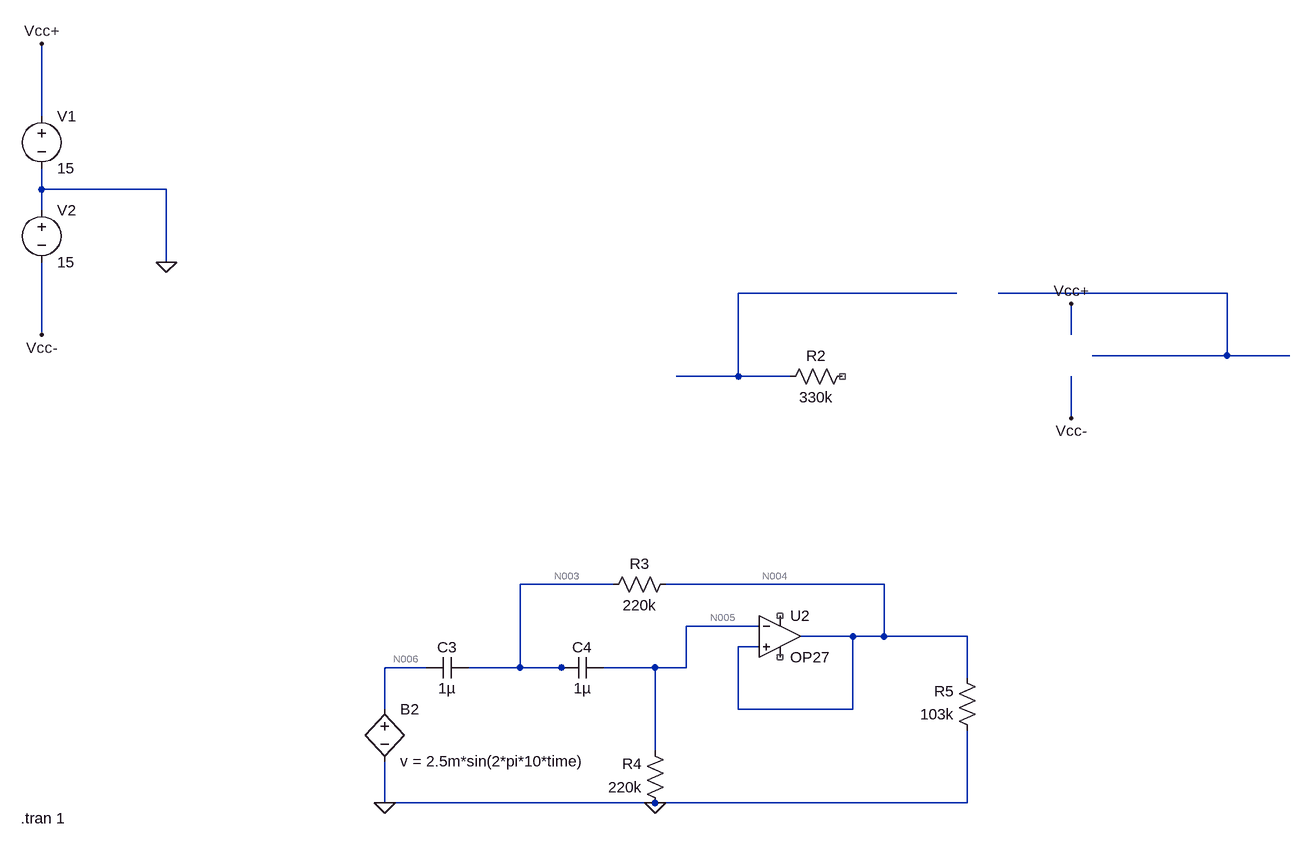
[diagram p0: schematic HighPassFilter.asc]
HighPassFilter.asc, the LTspice schematic file:
Version 4.1
SHEET 1 1252 792
WIRE -672 -304 -672 -416
WIRE -672 -192 -672 -224
WIRE -480 -192 -672 -192
WIRE -672 -160 -672 -192
WIRE -480 -80 -480 -192
WIRE 736 -32 400 -32
WIRE 1152 -32 800 -32
WIRE -672 32 -672 -80
WIRE 912 32 912 -16
WIRE 1152 64 1152 -32
WIRE 1152 64 944 64
WIRE 1248 64 1152 64
WIRE 400 96 400 -32
WIRE 400 96 304 96
WIRE 480 96 400 96
WIRE 912 160 912 96
WIRE 208 416 64 416
WIRE 624 416 288 416
WIRE 432 480 320 480
WIRE 576 496 496 496
WIRE 624 496 624 416
WIRE 624 496 576 496
WIRE 752 496 624 496
WIRE 432 512 400 512
WIRE -80 544 -144 544
WIRE 64 544 64 416
WIRE 64 544 -16 544
WIRE 128 544 64 544
WIRE 144 544 128 544
WIRE 272 544 192 544
WIRE 320 544 320 480
WIRE 320 544 272 544
WIRE 752 560 752 496
WIRE -144 608 -144 544
WIRE 400 608 400 512
WIRE 576 608 576 496
WIRE 576 608 400 608
WIRE 272 672 272 544
WIRE -144 752 -144 688
WIRE 272 752 -144 752
WIRE 752 752 752 640
WIRE 752 752 272 752
FLAG -480 -80 0
FLAG -672 -416 Vcc+
FLAG 912 -16 Vcc+
FLAG -672 32 Vcc-
FLAG 912 160 Vcc-
FLAG -144 752 0
FLAG 272 752 0
SYMBOL res 576 80 R90
WINDOW 0 0 56 VBottom 2
WINDOW 3 32 56 VTop 2
SYMATTR InstName R2
SYMATTR Value 330k
SYMBOL voltage -672 -320 R0
SYMATTR InstName V1
SYMATTR Value 15
SYMBOL voltage -672 -176 R0
SYMATTR InstName V2
SYMATTR Value 15
SYMBOL cap -16 528 R90
WINDOW 0 0 32 VBottom 2
WINDOW 3 32 32 VTop 2
SYMATTR InstName C3
SYMATTR Value 1µ
SYMBOL cap 192 528 R90
WINDOW 0 0 32 VBottom 2
WINDOW 3 32 32 VTop 2
SYMATTR InstName C4
SYMATTR Value 1µ
SYMBOL res 304 400 R90
WINDOW 0 0 56 VBottom 2
WINDOW 3 32 56 VTop 2
SYMATTR InstName R3
SYMATTR Value 220k
SYMBOL res 288 768 R180
WINDOW 0 36 76 Left 2
WINDOW 3 36 40 Left 2
SYMATTR InstName R4
SYMATTR Value 220k
SYMBOL OpAmps\\OP27 464 432 R0
SYMATTR InstName U2
SYMBOL bv -144 592 R0
SYMATTR InstName B2
SYMATTR Value v = 2.5m*sin(2*pi*10*time)
SYMBOL res 768 656 R180
WINDOW 0 36 76 Left 2
WINDOW 3 36 40 Left 2
SYMATTR InstName R5
SYMATTR Value 103k
TEXT -704 776 Left 2 !.tran 1

The netlist it stands for:
* HighPassFilter.asc
R2 NC_01 N001 330k
V1 Vcc+ 0 15
V2 0 Vcc- 15
C3 N003 N006 1µ
C4 N005 N003 1µ
R3 N004 N003 220k
R4 0 N005 220k
X§U2 N004 N005 NC_02 NC_03 N004 OP27  ; pins In+ In- V+ V- OUT
B2 N006 0 v = 2.5m*sin(2*pi*10*time)
R5 0 N004 103k
.tran 1
.lib ADI.lib
.backanno
.end

* Results of the author's LTspice run, read from the files saved beside the schematic
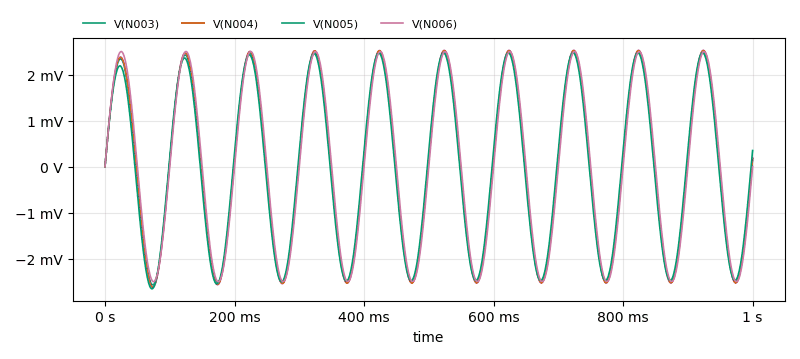
[diagram p1: Transient Analysis of HighPassFilter.asc, plotted from the saved traces]
* Transient Analysis, 1 run:
*   V(N003): min -2.569 mV, max 2.48 mV, average -19.72 µV, rms 1.751 mV, last 172.9 µV
*   V(N004): min -2.619 mV, max 2.525 mV, average -20.75 µV, rms 1.783 mV, last 182.5 µV
*   V(N005): min -2.654 mV, max 2.474 mV, average -38.43 µV, rms 1.744 mV, last 350.6 µV
*   V(N006): min -2.5 mV, max 2.5 mV, average 0 V, rms 1.768 mV, last 0 V